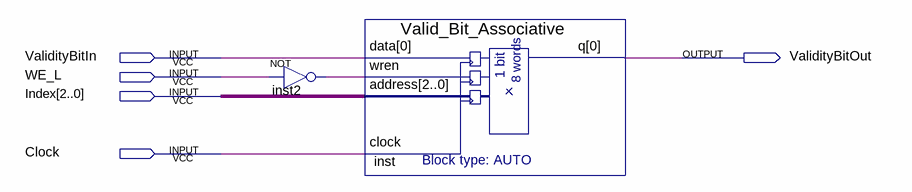
[diagram p0: schematic sheet]
// Quartus schematic ValidBit_Associative.bdf as structural Verilog: 2 symbols, 5 pins
module ValidBit_Associative (
  input  ValidityBitIn,
  input  WE_L,
  input  [2:0] Index,
  input  Clock,
  output ValidityBitOut
);

  wire inst2_out;

  not inst2 (inst2_out, WE_L);
  Valid_Bit_Associative inst (
    .data(ValidityBitIn), .wren(inst2_out), .address(Index), .clock(Clock), .q(ValidityBitOut));
endmodule
